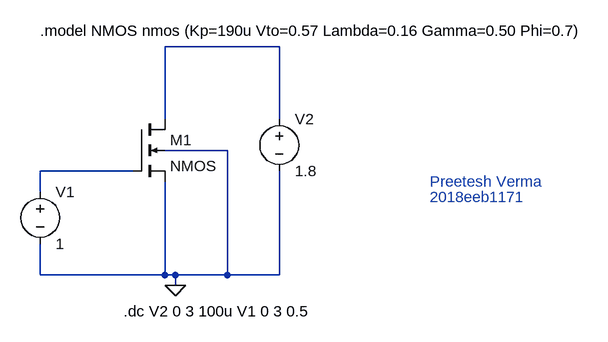
[diagram p0: schematic NMOS.asc]
NMOS.asc, the LTspice schematic file:
Version 4
SHEET 1 984 680
WIRE 400 0 224 0
WIRE 224 112 224 0
WIRE 400 112 400 0
WIRE 320 160 224 160
WIRE 176 192 32 192
WIRE 32 224 32 192
WIRE 32 352 32 304
WIRE 224 352 224 208
WIRE 224 352 32 352
WIRE 240 352 224 352
WIRE 320 352 320 160
WIRE 320 352 240 352
WIRE 400 352 400 192
WIRE 400 352 320 352
WIRE 240 368 240 352
FLAG 240 368 0
SYMBOL voltage 32 208 R0
WINDOW 123 0 0 Left 0
WINDOW 39 0 0 Left 0
SYMATTR InstName V1
SYMATTR Value 1
SYMBOL voltage 400 96 R0
WINDOW 123 0 0 Left 0
WINDOW 39 0 0 Left 0
SYMATTR InstName V2
SYMATTR Value 1.8
SYMBOL nmos4 176 112 R0
SYMATTR InstName M1
TEXT 160 408 Left 2 !.dc V2 0 3 100u V1 0 3 0.5
TEXT 32 -24 Left 2 !.model NMOS nmos (Kp=190u Vto=0.57 Lambda=0.16 Gamma=0.50 Phi=0.7)
TEXT 632 208 Left 2 ;Preetesh Verma
TEXT 632 232 Left 2 ;2018eeb1171

The netlist it stands for:
* NMOS.asc
V1 N002 0 1
V2 N001 0 1.8
M1 N001 N002 0 0 NMOS
.model NMOS NMOS
.model PMOS PMOS
.lib standard.mos
.dc V2 0 3 100u V1 0 3 0.5
.model NMOS nmos (Kp=190u Vto=0.57 Lambda=0.16 Gamma=0.50 Phi=0.7)
* Preetesh Verma
* 2018eeb1171
.backanno
.end